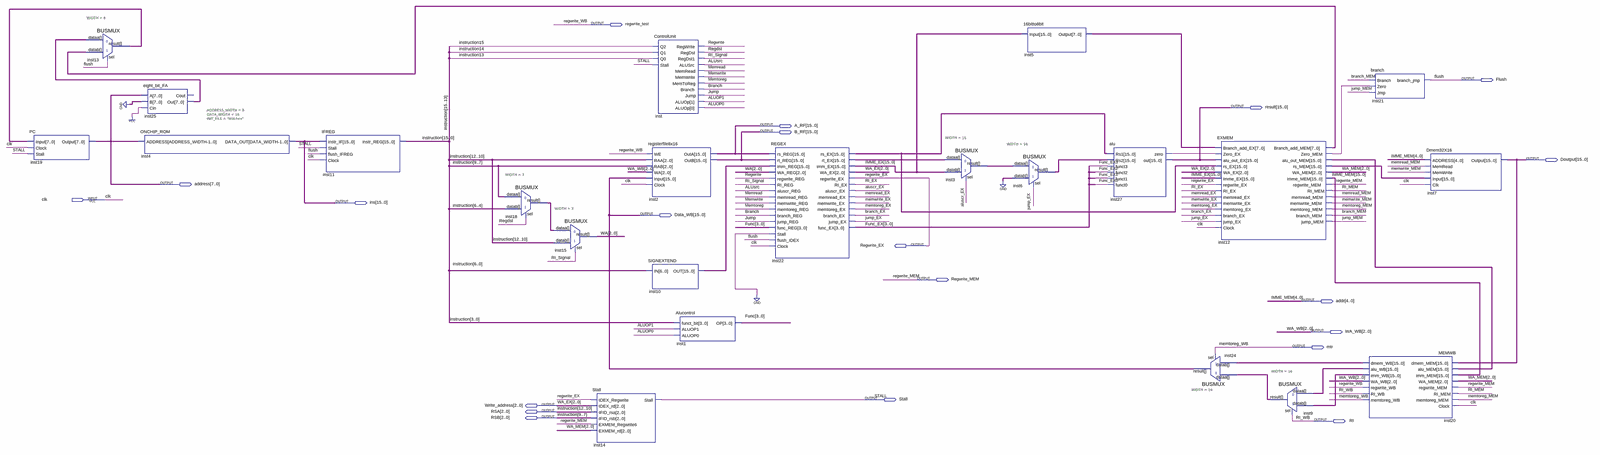
[diagram p0: schematic sheet, whole]
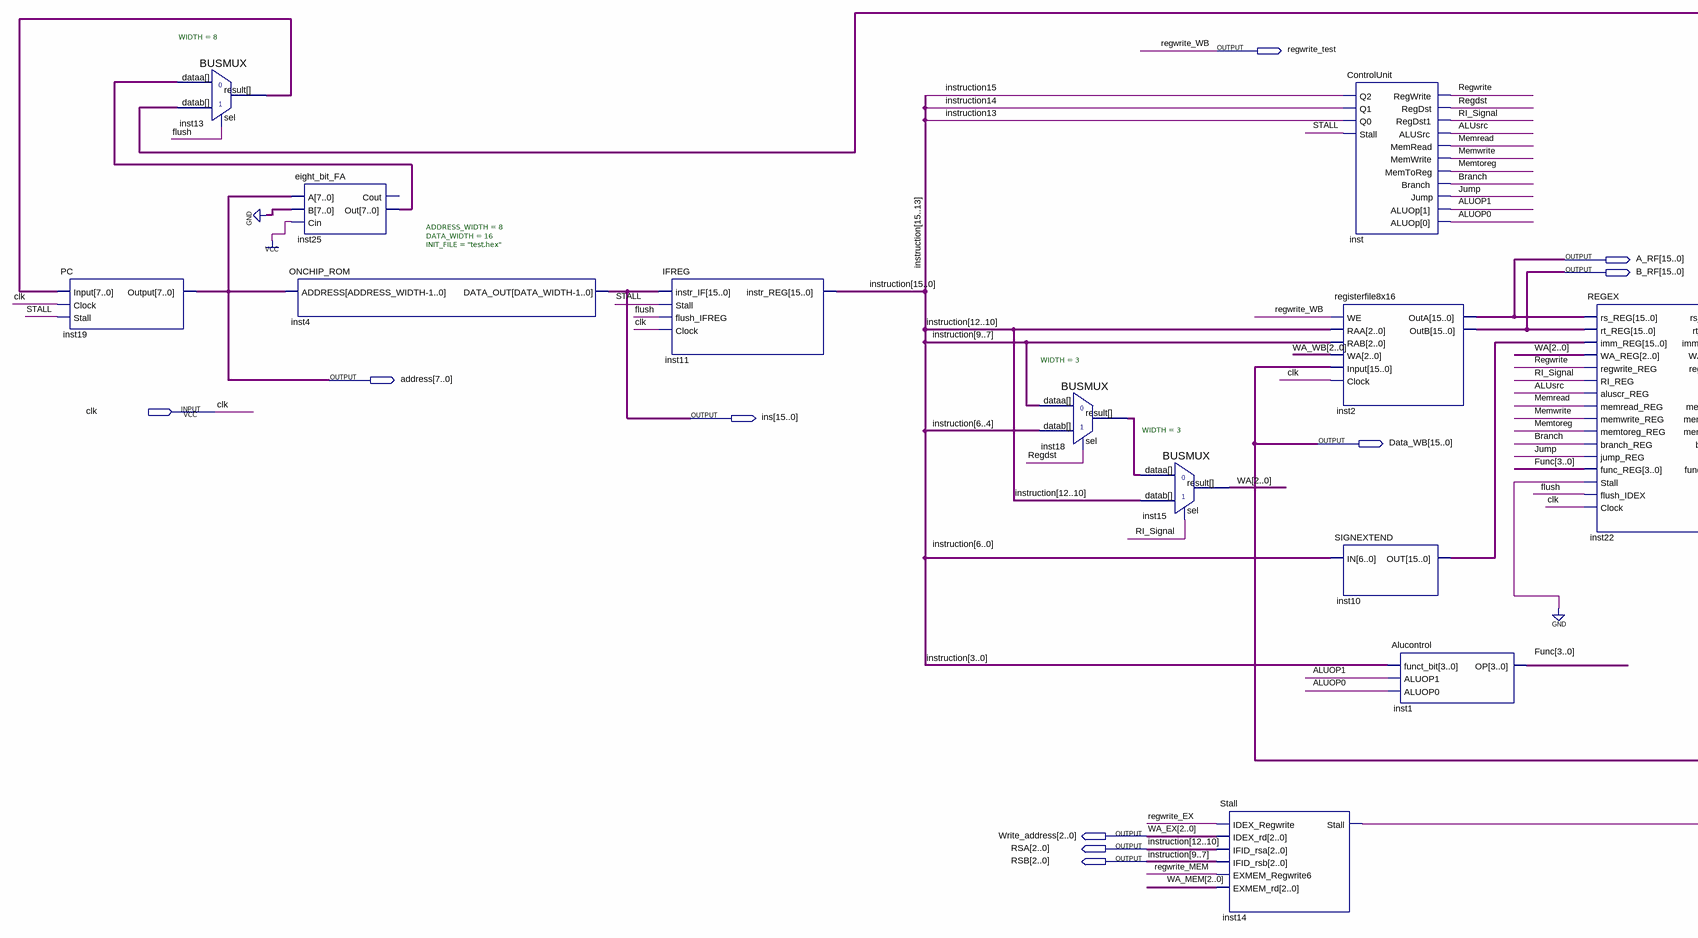
[diagram p1: schematic sheet, left part]
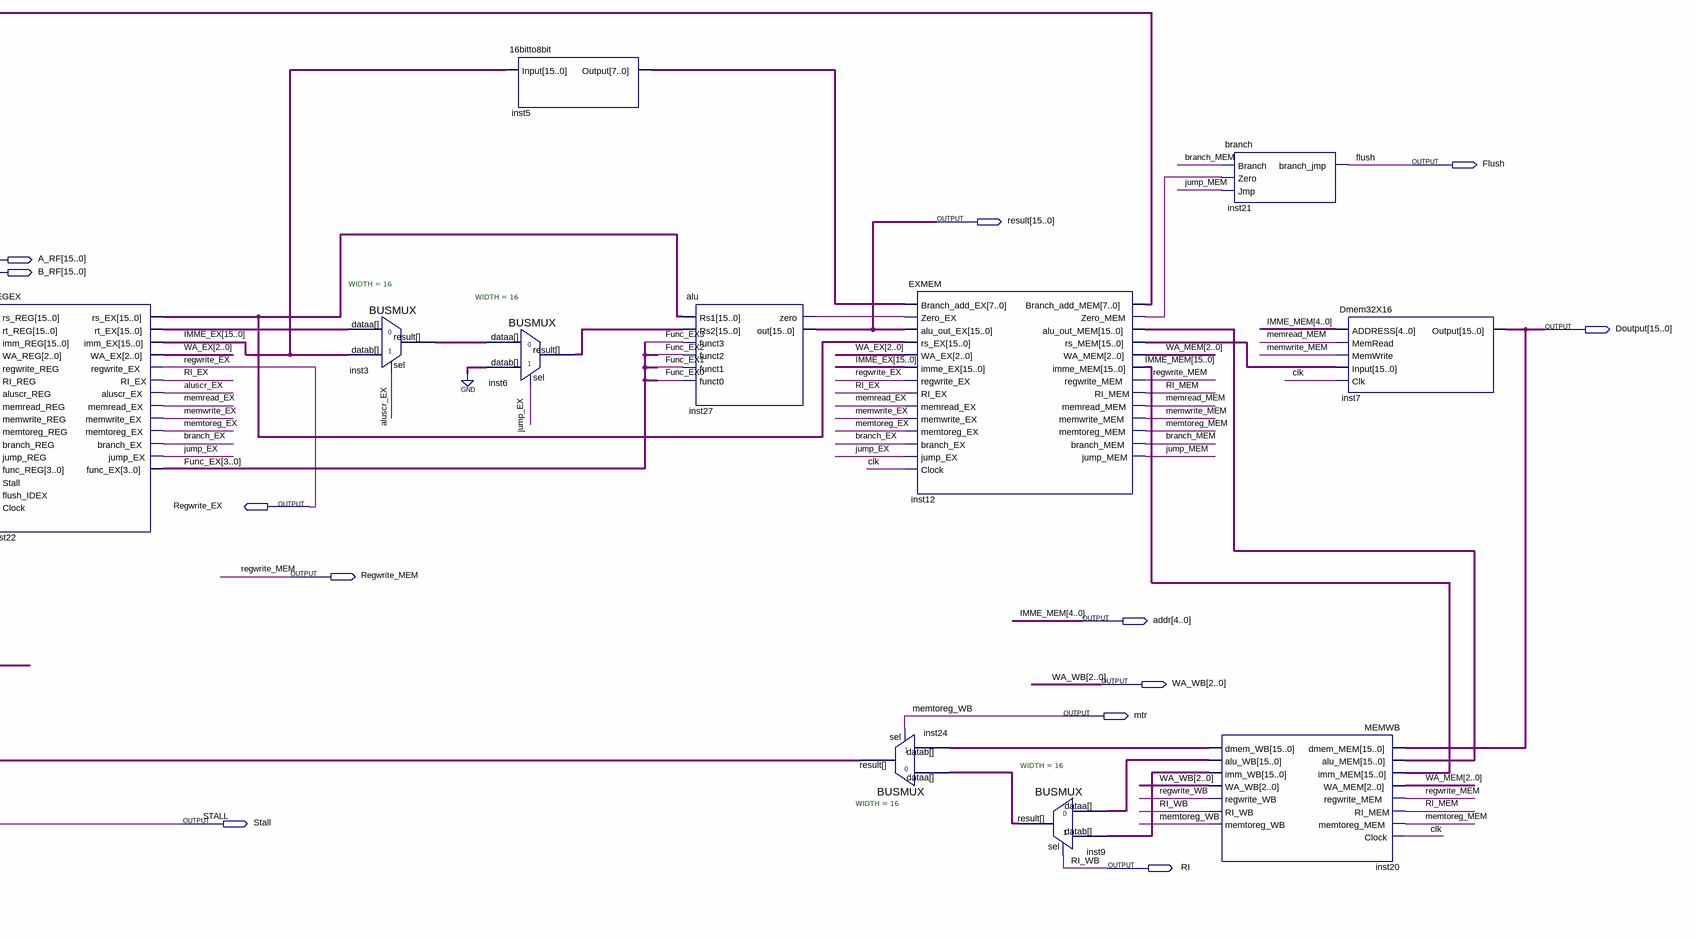
[diagram p2: schematic sheet, right part]
// Quartus schematic project.bdf as structural Verilog: 23 symbols, 20 pins
module project (
  input  clk,
  output regwrite_test,
  output Flush,
  output [15:0] result,
  output [15:0] A_RF,
  output [15:0] B_RF,
  output [15:0] Doutput,
  output [7:0] address,
  output [15:0] ins,
  output [15:0] Data_WB,
  output Regwrite_EX,
  output Regwrite_MEM,
  output [4:0] addr,
  output [2:0] WA_WB,
  output mtr,
  output Stall,
  output [2:0] Write_address,
  output [2:0] RSA,
  output [2:0] RSB,
  output RI
);

  wire ALUOP0, ALUOP1, aluscr_EX, ALUsrc, Branch, branch_EX, branch_MEM, inst12_zero_mem, inst27_zero, Jump,
       jump_EX, jump_MEM, Memread, memread_EX, memread_MEM, Memtoreg, memtoreg_EX, memtoreg_MEM, Memwrite,
       memwrite_EX, memwrite_MEM, Regdst, Regwrite, RI_EX, RI_MEM, RI_Signal;
  wire [2:0] inst18_result, WA, WA_MEM;
  wire [3:0] Func, Func_EX;
  wire [7:0] inst5_output, inst12_branch_add_mem, inst13_result, inst25_out;
  wire [15:0] IMME_EX, inst3_result, inst6_result, inst9_result, inst10_out, inst12_alu_out_mem,
       inst12_rs_mem, inst20_alu_wb, inst20_dmem_wb, inst20_imm_wb, inst22_rs_ex, inst22_rt_ex, instruction;
  wire [15:5] IMME_MEM;

  PC inst19 (.Input(inst13_result), .Clock(clk), .Stall(Stall), .Output(address));
  BUSMUX #(.WIDTH(8)) inst13 (.datab(inst12_branch_add_mem), .sel(Flush), .dataa(inst25_out), .result(inst13_result));
  ONCHIP_ROM #(.ADDRESS_WIDTH(8), .DATA_WIDTH(16), .INIT_FILE("test.hex")) inst4 (.ADDRESS(address), .DATA_OUT(ins));
  eight_bit_FA inst25 (.A(address), .B({8{1'b0}}), .Cin(1'b1), .Out(inst25_out));  // open: Cout
  IFREG inst11 (
    .instr_IF(ins), .Stall(Stall), .flush_IFREG(Flush), .Clock(clk),
    .instr_REG({instruction[15:13], RSA, RSB, instruction[6:0]}));
  BUSMUX #(.WIDTH(3)) inst18 (.datab(instruction[6:4]), .sel(Regdst), .dataa(RSB), .result(inst18_result));
  BUSMUX #(.WIDTH(3)) inst15 (.datab(RSA), .sel(RI_Signal), .dataa(inst18_result), .result(WA));
  Stall inst14 (
    .IDEX_Regwrite(Regwrite_EX), .IDEX_rd(Write_address), .IFID_rsa(RSA), .IFID_rsb(RSB),
    .EXMEM_Regwrite6(Regwrite_MEM), .EXMEM_rd(WA_MEM), .Stall(Stall));
  ControlUnit inst (
    .Q2(instruction[15]), .Q1(instruction[14]), .Q0(instruction[13]), .Stall(Stall), .RegWrite(Regwrite),
    .RegDst(Regdst), .RegDst1(RI_Signal), .ALUSrc(ALUsrc), .MemRead(Memread), .MemWrite(Memwrite),
    .MemToReg(Memtoreg), .Branch(Branch), .Jump(Jump), .ALUOp({ALUOP1, ALUOP0}));
  registerfile8x16 inst2 (
    .WE(regwrite_test), .RAA(RSA), .RAB(RSB), .WA(WA_WB), .Input(Data_WB), .Clock(clk), .OutA(A_RF),
    .OutB(B_RF));
  SIGNEXTEND inst10 (.IN(instruction[6:0]), .OUT(inst10_out));
  Alucontrol inst1 (.funct_bit(instruction[3:0]), .ALUOP1(ALUOP1), .ALUOP0(ALUOP0), .OP(Func));
  REGEX inst22 (
    .rs_REG(A_RF), .rt_REG(B_RF), .imm_REG(inst10_out), .WA_REG(WA), .regwrite_REG(Regwrite),
    .RI_REG(RI_Signal), .aluscr_REG(ALUsrc), .memread_REG(Memread), .memwrite_REG(Memwrite),
    .memtoreg_REG(Memtoreg), .branch_REG(Branch), .jump_REG(Jump), .func_REG(Func), .Stall(1'b0),
    .flush_IDEX(Flush), .Clock(clk), .rs_EX(inst22_rs_ex), .rt_EX(inst22_rt_ex), .imm_EX(IMME_EX),
    .WA_EX(Write_address), .regwrite_EX(Regwrite_EX), .RI_EX(RI_EX), .aluscr_EX(aluscr_EX),
    .memread_EX(memread_EX), .memwrite_EX(memwrite_EX), .memtoreg_EX(memtoreg_EX), .branch_EX(branch_EX),
    .jump_EX(jump_EX), .func_EX(Func_EX));
  BUSMUX #(.WIDTH(16)) inst3 (.datab(IMME_EX), .sel(aluscr_EX), .dataa(inst22_rt_ex), .result(inst3_result));
  \16bitto8bit  inst5 (.Input(IMME_EX), .Output(inst5_output));
  BUSMUX #(.WIDTH(16)) inst6 (.datab({16{1'b0}}), .sel(jump_EX), .dataa(inst3_result), .result(inst6_result));
  alu inst27 (
    .Rs1(inst22_rs_ex), .Rs2(inst6_result), .funct3(Func_EX[3]), .funct2(Func_EX[2]), .funct1(Func_EX[1]),
    .funct0(Func_EX[0]), .zero(inst27_zero), .out(result));
  BUSMUX #(.WIDTH(16)) inst24 (.datab(inst20_dmem_wb), .sel(mtr), .dataa(inst9_result), .result(Data_WB));
  EXMEM inst12 (
    .Branch_add_EX(inst5_output), .Zero_EX(inst27_zero), .alu_out_EX(result), .rs_EX(inst22_rs_ex),
    .WA_EX(Write_address), .imme_EX(IMME_EX), .regwrite_EX(Regwrite_EX), .RI_EX(RI_EX),
    .memread_EX(memread_EX), .memwrite_EX(memwrite_EX), .memtoreg_EX(memtoreg_EX), .branch_EX(branch_EX),
    .jump_EX(jump_EX), .Clock(clk), .Branch_add_MEM(inst12_branch_add_mem), .Zero_MEM(inst12_zero_mem),
    .alu_out_MEM(inst12_alu_out_mem), .rs_MEM(inst12_rs_mem), .WA_MEM(WA_MEM), .imme_MEM({IMME_MEM, addr}),
    .regwrite_MEM(Regwrite_MEM), .RI_MEM(RI_MEM), .memread_MEM(memread_MEM), .memwrite_MEM(memwrite_MEM),
    .memtoreg_MEM(memtoreg_MEM), .branch_MEM(branch_MEM), .jump_MEM(jump_MEM));
  BUSMUX #(.WIDTH(16)) inst9 (.datab(inst20_imm_wb), .sel(RI), .dataa(inst20_alu_wb), .result(inst9_result));
  branch inst21 (.Branch(branch_MEM), .Zero(inst12_zero_mem), .Jmp(jump_MEM), .branch_jmp(Flush));
  MEMWB inst20 (
    .dmem_MEM(Doutput), .alu_MEM(inst12_alu_out_mem), .imm_MEM({IMME_MEM, addr}), .WA_MEM(WA_MEM),
    .regwrite_MEM(Regwrite_MEM), .RI_MEM(RI_MEM), .memtoreg_MEM(memtoreg_MEM), .Clock(clk),
    .dmem_WB(inst20_dmem_wb), .alu_WB(inst20_alu_wb), .imm_WB(inst20_imm_wb), .WA_WB(WA_WB),
    .regwrite_WB(regwrite_test), .RI_WB(RI), .memtoreg_WB(mtr));
  Dmem32X16 inst7 (
    .ADDRESS(addr), .MemRead(memread_MEM), .MemWrite(memwrite_MEM), .Input(inst12_rs_mem), .Clk(clk),
    .Output(Doutput));

  // Other names for the same wires on the sheet: IMME_MEM[4:0] = addr; instruction[12:7] = {RSA, RSB};
  //   memtoreg_WB = mtr; regwrite_WB = regwrite_test; RI_WB = RI; WA_EX[2:0] = Write_address
endmodule
